# Altium schematic sheet can.SchDoc
size A4 portrait
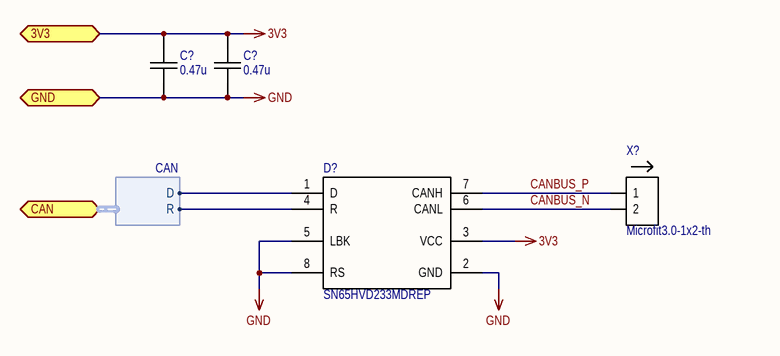
[diagram p0: can.SchDoc]

## Parts
(Parts that share a designator on the sheet are numbered #1, #2 ... from top to bottom, then left to right.)
C?#1  value 0.47u  [CAP-0402]  (hidden comment: CAP-0.47u-10%-50V-X7R-0402)
C?#2  value 0.47u  [CAP-0402]  (hidden comment: CAP-0.47u-10%-50V-X7R-0402)
D?  SN65HVD233MDREP  [SO-8]
X?  Microfit3.0-1x2-th  [Microfit3.0-1x2-th]

## Ports
3V3 (bidir), CAN (bidir, harness CAN), GND (bidir)

## Harnesses
CAN: D, R

## Nets
3V3: C?#1.2 C?#2.2 D?.3(VCC) ; port 3V3
GND: C?#1.1 C?#2.1 D?.2(GND) D?.5(LBK) D?.8(RS) ; port GND
CANBUS_N: D?.6(CANL) X?.2
CANBUS_P: D?.7(CANH) X?.1
NetD?_1: D?.1(D) ; port CAN.D
NetD?_4: D?.4(R) ; port CAN.R

## Library data of the parts
C?#1 C?#2 = CAP-0402: Конденсатор; Tolerance: 10; Voltage: 50; Part Number: *; Manufacturer: *; Temperature: X7R
D? = SN65HVD233: Интегральная микросхема; Manufacturer: TI; Part Number: SN65HVD233MDREP
X? = Microfit3.0-1x2-th: Manufacturer: *; Part Number: Microfit3.0-1x2-th